# EAGLE design quadcopter (EAGLE 5.11)
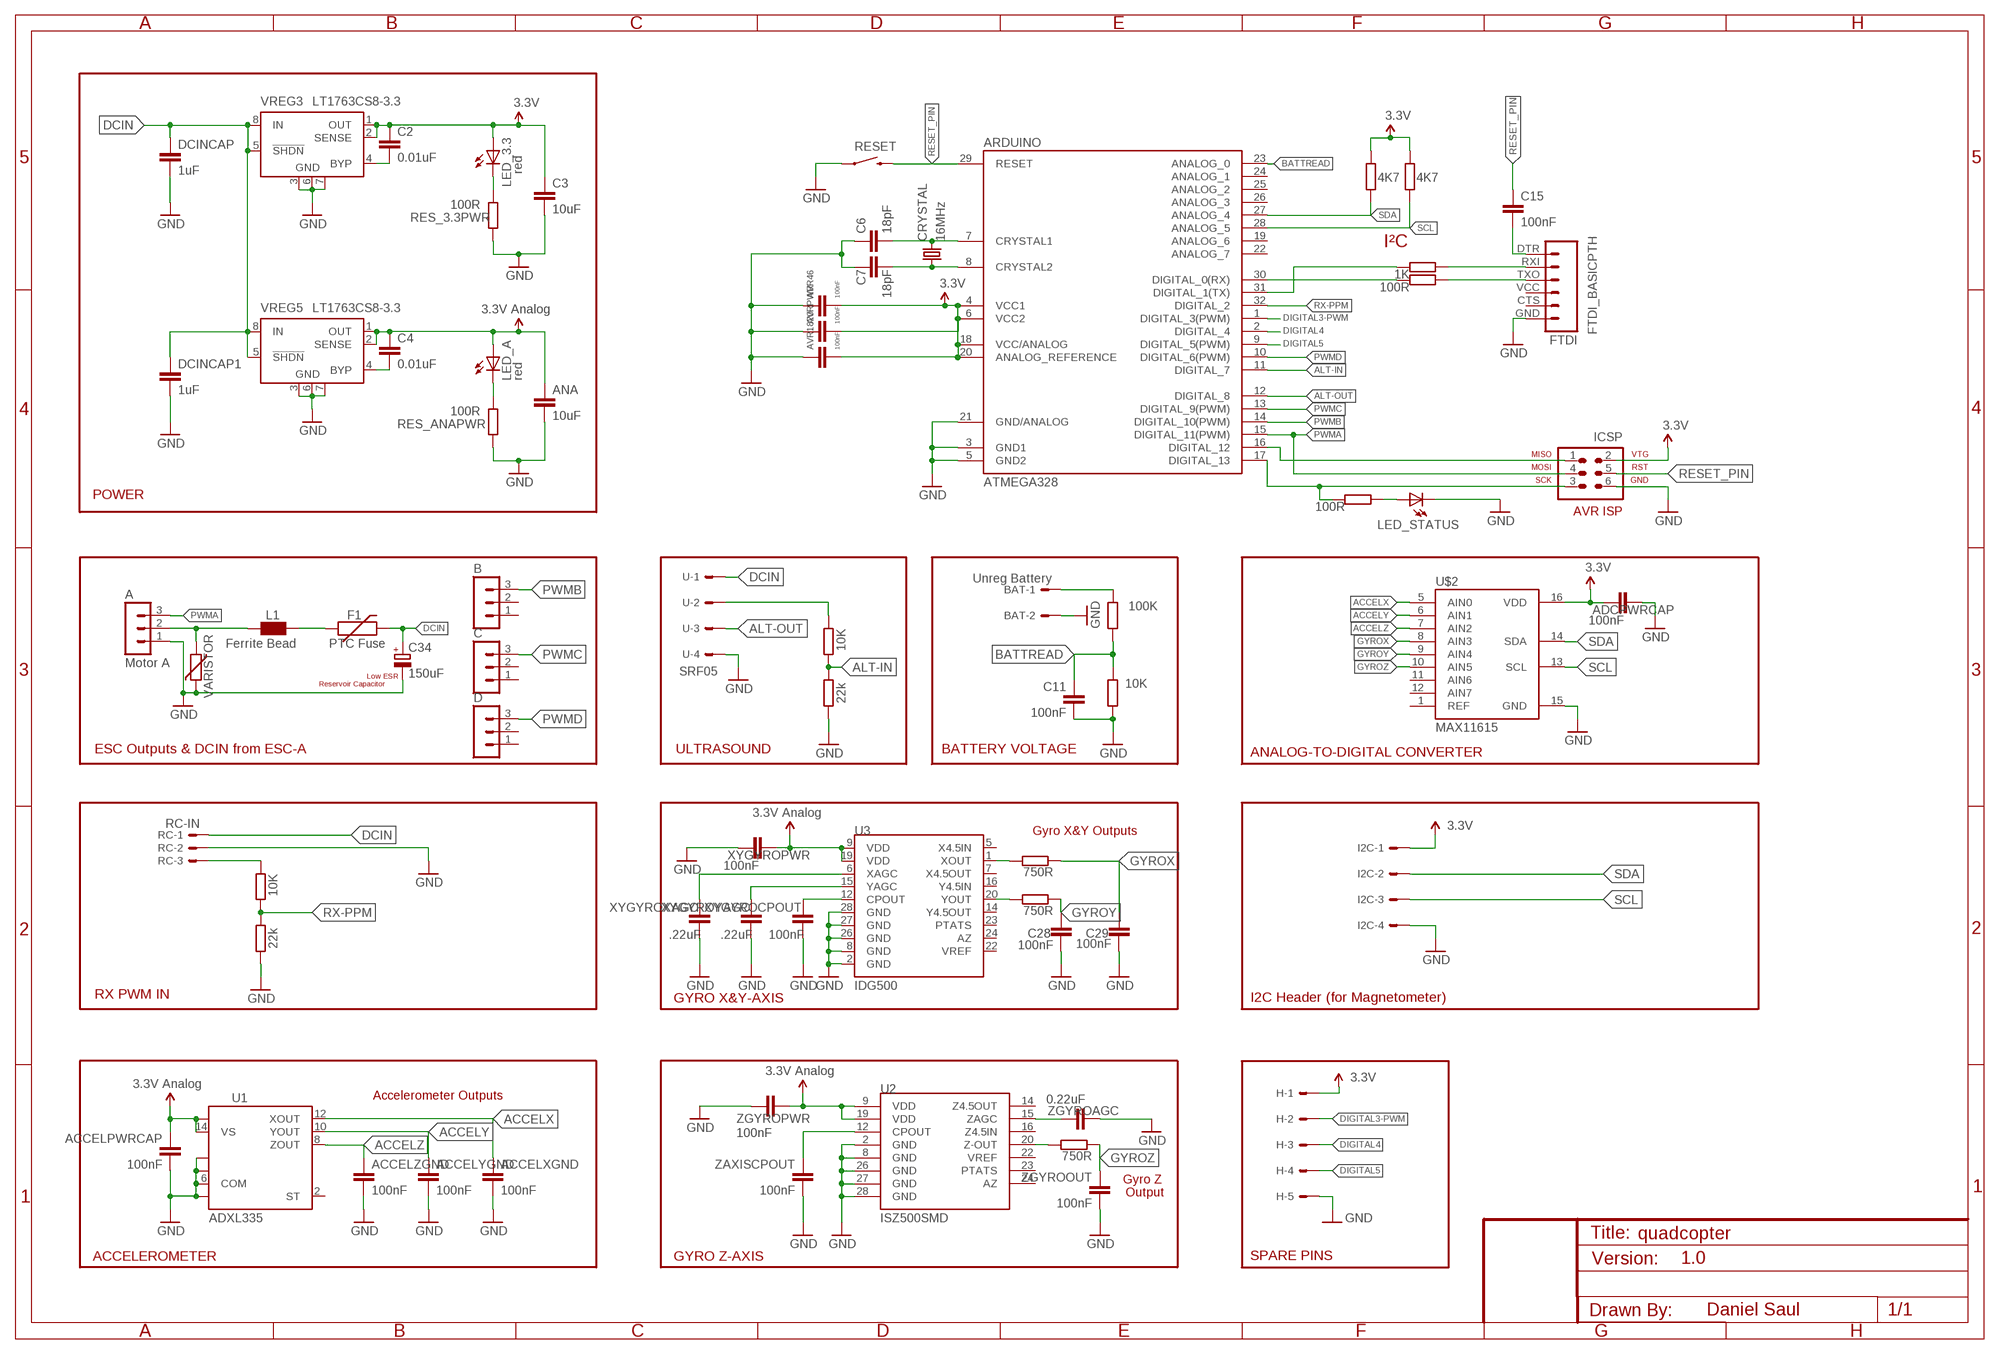
[diagram p0: schematic, sheet 1]

## Parts
A  Motor A  MA03-1  [MA03-1]
ACCELPWRCAP  100nF  CAP0805  [0805]
ACCELXGND  100nF  CAP0805  [0805]
ACCELYGND  100nF  CAP0805  [0805]
ACCELZGND  100nF  CAP0805  [0805]
ADCPWRCAP  100nF  CAP0805  [0805]
ANA  10uF  CAP0805  [0805]
ARDUINO  ATMEGA328  ATMEGA168-AU  [TQFP32-08]
AVR46  100nF  CAP0805  [0805]
AVR1820  100nF  CAP0805  [0805]
AVRPWR  100nF  CAP0805  [0805]
B  MA03-1  [MA03-1]
BAT  Unreg Battery  22-27-2021-02  [6410-02]
C  MA03-1  [MA03-1]
C2  0.01uF  CAP0805  [0805]
C3  10uF  CAP0805  [0805]
C4  0.01uF  CAP0805  [0805]
C6  18pF  CAP0805  [0805]
C7  18pF  CAP0805  [0805]
C11  100nF  CAP0805  [0805]
C15  100nF  CAP0805  [0805]
C28  100nF  CAP0805  [0805]
C29  100nF  CAP0805  [0805]
C34  150uF  CPOL-EUSANYO_SMD_E7  [SANYO-OSCON_SMD_E7]
CRYSTAL  16MHz  CRYSTAL5X3  [CRYSTAL-SMD-5X3]
D  MA03-1  [MA03-1]
DCINCAP  1uF  CAP0805  [0805]
DCINCAP1  1uF  CAP0805  [0805]
F1  PTC Fuse  PTCSMD  [PTC-1206]
FTDI  FTDI_BASICPTH  [FTDI_BASIC]
H  22-27-2051-05  [6410-05]
I2C  22-27-2041-04  [6410-04]
ICSP  AVR-ISP-6  [AVR-ISP-6]
L1  Ferrite Bead  WE-CBF_0603  [0603]
LED_3.3  red  LEDCHIP-LED0805  [CHIP-LED0805]
LED_A  red  LEDCHIP-LED0805  [CHIP-LED0805]
LED_STATUS  blue  LEDCHIP-LED0805  [CHIP-LED0805]
R1  VARISTOR  VARISTORCN1206  [CT/CN1206]
RC  RC-IN  22-23-2031  [22-23-2031]
RES_3.3PWR  100R  R-EU_R0805  [R0805]
RES_3.3PWR1  4K7  R-EU_R0805  [R0805]
RES_3.3PWR2  4K7  R-EU_R0805  [R0805]
RES_ANAPWR  100R  R-EU_R0805  [R0805]
RES_BATT  100K  R-EU_R0805  [R0805]
RES_BATT1  10K  R-EU_R0805  [R0805]
RES_BATT2  10K  R-EU_R0805  [R0805]
RES_BATT3  22k  R-EU_R0805  [R0805]
RES_BATT4  10K  R-EU_R0805  [R0805]
RES_BATT5  22k  R-EU_R0805  [R0805]
RES_SHT1  1K  R-EU_R0805  [R0805]
RES_SHT2  100R  R-EU_R0805  [R0805]
RES_SHT3  100R  R-EU_R0805  [R0805]
RES_WIND1  750R  R-EU_R0805  [R0805]
RES_WIND2  750R  R-EU_R0805  [R0805]
RES_WIND3  750R  R-EU_R0805  [R0805]
RESET  SWITCH-MOMENTARY-2-SMD-1101NE  [TACTILE-SWITCH-1101NE]
U  SRF05  22-27-2041-04  [6410-04]
U1  ADXL335  [LFCSP-16]
U2  ISZ500SMD  [QFN-28_6X8]
U3  IDG500  [SPARKFUN_IDG500]
U$2  MAX11615  MAX11615MAX11615  [QSOP16]
VREG3  LT1763CS8-3.3  [SOIC8]
VREG5  LT1763CS8-3.3  [SOIC8]
XYGYROCPOUT  100nF  CAP0805  [0805]
XYGYROPWR  100nF  CAP0805  [0805]
XYGYROXAGC  .22uF  CAP0805  [0805]
XYGYROYAGC  .22uF  CAP0805  [0805]
ZAXISCPOUT  100nF  CAP0805  [0805]
ZGYROAGC  0.22uF  CAP0805  [0805]
ZGYROOUT  100nF  CAP0805  [0805]
ZGYROPWR  100nF  CAP0805  [0805]

## Nets
3.3V: ADCPWRCAP.1 ARDUINO.4(VCC1) ARDUINO.6(VCC2) ARDUINO.18(VCC/ANALOG) ARDUINO.20(ANALOG_REFERENCE) AVR46.2 AVR1820.2 AVRPWR.2 C2.1 C3.1 H.1 I2C.1 ICSP.2 LED_3.3.A RES_3.3PWR1.1 RES_3.3PWR2.1 U$2.16(VDD) VREG3.1(OUT) VREG3.2(SENSE)
3.3VANALOG: ACCELPWRCAP.1 ANA.1 C4.1 LED_A.A U1.14(VS) U1.15(VS) U2.9(VDD) U2.19(VDD) U3.9(VDD) U3.19(VDD) VREG5.1(OUT) VREG5.2(SENSE) XYGYROPWR.2 ZGYROPWR.2 ; supply symbol labelled 3.3V Analog
16: ARDUINO.16(DIGITAL_12) ICSP.1
ACCELX: ACCELXGND.1 U1.12(XOUT) U$2.5(AIN0)
ACCELY: ACCELYGND.1 U1.10(YOUT) U$2.6(AIN1)
ACCELZ: ACCELZGND.1 U1.8(ZOUT) U$2.7(AIN2)
ALT-IN: ARDUINO.11(DIGITAL_7) RES_BATT2.2 RES_BATT3.1
ALT-OUT: ARDUINO.12(DIGITAL_8) U.3
BATTREAD: ARDUINO.23(ANALOG_0) C11.1 RES_BATT1.1 RES_BATT.2
DCIN: C34.+ DCINCAP1.1 DCINCAP.1 F1.2 RC.1 U.1 VREG3.5(!SHDN) VREG3.8(IN) VREG5.5(!SHDN) VREG5.8(IN)
DIGITAL3-PWM: ARDUINO.1(DIGITAL_3(PWM)) H.2
DIGITAL4: ARDUINO.2(DIGITAL_4) H.3
DIGITAL5: ARDUINO.9(DIGITAL_5(PWM)) H.4
GND: A.1 ACCELPWRCAP.2 ACCELXGND.2 ACCELYGND.2 ACCELZGND.2 ADCPWRCAP.2 ANA.2 ARDUINO.3(GND1) ARDUINO.5(GND2) ARDUINO.21(GND/ANALOG) AVR46.1 AVR1820.1 AVRPWR.1 BAT.2 C3.2 C6.1 C7.1 C11.2 C28.2 C29.2 C34.- DCINCAP1.2 DCINCAP.2 FTDI.GND H.5 I2C.4 ICSP.6 LED_STATUS.C R1.2 RC.2 RES_3.3PWR.2 RES_ANAPWR.2 RES_BATT1.2 RES_BATT3.2 RES_BATT5.2 RESET.P$1 U1.3(COM) U1.5(COM) U1.6(COM) U1.7(COM) U2.2(GND) U2.8(GND) U2.26(GND) U2.27(GND) U2.28(GND) U3.2(GND) U3.8(GND) U3.26(GND) U3.27(GND) U3.28(GND) U$2.15(GND) U.4 VREG3.3(GND) VREG3.6(GND) VREG3.7(GND) VREG5.3(GND) VREG5.6(GND) VREG5.7(GND) XYGYROCPOUT.2 XYGYROPWR.1 XYGYROXAGC.2 XYGYROYAGC.2 ZAXISCPOUT.2 ZGYROAGC.2 ZGYROOUT.2 ZGYROPWR.1
GYROX: C29.1 RES_WIND3.2 U$2.8(AIN3)
GYROY: C28.1 RES_WIND2.2 U$2.9(AIN4)
GYROZ: RES_WIND1.2 U$2.10(AIN5) ZGYROOUT.1
N$1: C4.2 VREG5.4(BYP)
N$2: BAT.1 RES_BATT.1
N$3: LED_3.3.C RES_3.3PWR.1
N$4: C2.2 VREG3.4(BYP)
N$5: LED_A.C RES_ANAPWR.1
N$7: ARDUINO.7(CRYSTAL1) C6.2 CRYSTAL.3
N$8: ARDUINO.8(CRYSTAL2) C7.2 CRYSTAL.1
N$11: FTDI.RXI RES_SHT1.2
N$12: FTDI.TXO RES_SHT3.2
N$13: C15.2 FTDI.DTR
N$14: F1.1 L1.2
N$15: RES_BATT2.1 U.2
N$16: ARDUINO.17(DIGITAL_13) ICSP.3 RES_SHT2.1
N$17: LED_STATUS.A RES_SHT2.2
N$19: RC.3 RES_BATT4.1
N$20: U2.15(ZAGC) ZGYROAGC.1
N$28: U2.12(CPOUT) ZAXISCPOUT.1
N$29: RES_WIND1.1 U2.20(Z-OUT)
N$30: U3.15(YAGC) XYGYROYAGC.1
N$31: U3.12(CPOUT) XYGYROCPOUT.1
N$32: U3.6(XAGC) XYGYROXAGC.1
N$33: RES_WIND2.1 U3.20(YOUT)
N$34: RES_WIND3.1 U3.1(XOUT)
PWMA: A.3 ARDUINO.15(DIGITAL_11(PWM)) ICSP.4
PWMB: ARDUINO.14(DIGITAL_10(PWM)) B.3
PWMC: ARDUINO.13(DIGITAL_9(PWM)) C.3
PWMD: ARDUINO.10(DIGITAL_6(PWM)) D.3
RC-IN1: ARDUINO.31(DIGITAL_1(TX)) RES_SHT1.1
RC-IN2: ARDUINO.30(DIGITAL_0(RX)) RES_SHT3.1
RESET_PIN: ARDUINO.29(RESET) C15.1 ICSP.5 RESET.P$2
RX-PPM: ARDUINO.32(DIGITAL_2) RES_BATT4.2 RES_BATT5.1
S: A.2 L1.1 R1.1
SCL: ARDUINO.28(ANALOG_5) I2C.3 RES_3.3PWR1.2 U$2.13(SCL)
SDA: ARDUINO.27(ANALOG_4) I2C.2 RES_3.3PWR2.2 U$2.14(SDA)
Unconnected: ARDUINO.19(ANALOG_6) ARDUINO.22(ANALOG_7) ARDUINO.24(ANALOG_1) ARDUINO.25(ANALOG_2) ARDUINO.26(ANALOG_3) B.1 B.2 C.1 C.2 D.1 D.2 FTDI.CTS FTDI.VCC U1.2(ST) U2.14(Z4.5OUT) U2.16(Z4.5IN) U2.22(VREF) U2.23(PTATS) U2.24(AZ) U3.5(X4.5IN) U3.7(X4.5OUT) U3.14(Y4.5OUT) U3.16(Y4.5IN) U3.22(VREF) U3.23(PTATS) U3.24(AZ) U$2.1(REF) U$2.11(AIN6) U$2.12(AIN7)

## Notes on the sheet
- I²C
- POWER
- Low ESR
- Reservoir Capacitor
- ESC Outputs & DCIN from ESC-A | ULTRASOUND | BATTERY VOLTAGE | ANALOG-TO-DIGITAL CONVERTER
- Gyro X&Y Outputs
- RX PWM IN | GYRO X&Y-AXIS | I2C Header (for Magnetometer)
- Accelerometer Outputs
- Gyro Z
- Output
- ACCELEROMETER | GYRO Z-AXIS | SPARE PINS | 1.0
- Daniel Saul

## Library data of the parts
A B C D = con-lstb:MA03-1: PIN HEADER; OC_FARNELL: unknown; OC_NEWARK: unknown
ACCELPWRCAP ACCELXGND ACCELYGND ACCELZGND ADCPWRCAP ANA AVR46 AVR1820 AVRPWR C2-C4 C6 C7 C11 C15 C28 C29 DCINCAP DCINCAP1 XYGYROCPOUT XYGYROPWR XYGYROXAGC XYGYROYAGC ZAXISCPOUT ZGYROAGC ZGYROOUT ZGYROPWR = SparkFun:CAP: Capacitor Standard 0603 ceramic capacitor, and 0.1" leaded capacitor.
ARDUINO = Arduino-AVR:ATMEGA168
BAT = con-molex:22-?-02: CONNECTOR wire to board 2.54 mm (.1 inch) pitch header; OC_FARNELL: unknown; OC_NEWARK: unknown
C34 = rcl:CPOL-EU: POLARIZED CAPACITOR, European symbol
CRYSTAL = SparkFun:CRYSTAL: Crystals Various standard crystals. Proven footprints. Spark Fun Electronics SKU : COM-00534
F1 = SparkFun:PTC: Resettable Fuse PTC Resettable Fuse. Spark Fun Electronics SKU : COM-08357
FTDI = SparkFun:FTDI_BASIC: FTDI Basic: 3.3V and 5V
H = con-molex:22-?-05: CONNECTOR wire to board 2.54 mm (.1 inch) pitch header; OC_FARNELL: unknown; OC_NEWARK: unknown
I2C U = con-molex:22-?-04: CONNECTOR wire to board 2.54 mm (.1 inch) pitch header; OC_FARNELL: unknown; OC_NEWARK: unknown
ICSP = avr-4:AVR-ISP-6: AVR ISP-6 Serial Programming Header
L1 = wuerth-elektronik:WE-CBF: SMD EMI Suppression Ferrite Beads - excellent anti-EMI properties - low DCR - impedances till 3000 ohms - rated current up to 6 A
LED_3.3 LED_A LED_STATUS = led:LED: LED OSRAM: - CHIPLED LG R971, LG N971, LY N971, LG Q971, LY Q971, LO R971, LY R971 LH N974, LH R974 LS Q976, LO Q976, LY Q976 LO Q996 - Hyper CHIPLED LW Q18S LB Q993, LB Q99A, LB R99A - SideLED LS A670, LO A670, LY A670, LG A670, LP A670 LB A673, LV A673, LT A673, LW A673 LH A674 LY A675 LS A676, LA A676, LO A676, LY A676, LW A676 LS A679, LY A679, LG A679 - Hyper Micro SIDELED® LS Y876, LA Y876, LO Y876, LY Y876 LT Y87S - SmartLED LW L88C, LW L88S LB L89C, LB L89S, LG L890 LS L89K, LO L89K, LY L89K LS L896, LA L896, LO L896, LY L896 - TOPLED LS T670, LO T670, LY T670, LG T670, LP T670 LSG T670, LSP T670, LSY T670, LOP T670, LYG T670 LG T671, LOG T671, LSG T671 LB T673, LV T673, LT T673, LW T673 LH T674 LS T676, LA T676, LO T676, LY T676, LB T676, LH T676, LSB T676, LW T676 LB T67C, LV T67C, LT T67C, LS T67K, LO T67K, LY T67K, LW E67C LS E67B, LA E67B, LO E67B, LY E67B, LB E67C, LV E67C, LT E67C LW T67C LS T679, LY T679, LG T679 LS T770, LO T770, LY T770, LG T770, LP T770 LB T773, LV T773, LT T773, LW T773 LH T774 LS E675, LA E675, LY E675, LS T675 LS T776, LA T776, LO T776, LY T776, LB T776 LHGB T686 LT T68C, LB T68C - Hyper Mini TOPLED® LB M676 - Mini TOPLED Santana® LG M470 LS M47K, LO M47K, LY M47K Source: http://www.osram.convergy.de LUXEON: - LUMILED® LXK2-PW12-R00, LXK2-PW12-S00, LXK2-PW14-U00, LXK2-PW14-V00 LXK2-PM12-R00, LXK2-PM12-S00, LXK2-PM14-U00 LXK2-PE12-Q00, LXK2-PE12-R00, LXK2-PE12-S00, LXK2-PE14-T00, LXK2-PE14-U00 LXK2-PB12-K00, LXK2-PB12-L00, LXK2-PB12-M00, LXK2-PB14-N00, LXK2-PB14-P00, LXK2-PB14-Q00 LXK2-PR12-L00, LXK2-PR12-M00, LXK2-PR14-Q00, LXK2-PR14-R00 LXK2-PD12-Q00, LXK2-PD12-R00, LXK2-PD12-S00 LXK2-PH12-R00, LXK2-PH12-S00 LXK2-PL12-P00, LXK2-PL12-Q00, LXK2-PL12-R00 Source: www.luxeon.com KINGBRIGHT: KA-3528ASYC Source: www.kingbright.com
R1 = varistor:VARISTOR: VARISTOR
RC = con-molex:22-23-2031: .100" (2.54mm) Center Header - 3 Pin; MF: MOLEX; MPN: 22-23-2031; OC_FARNELL: 1462950; OC_NEWARK: 30C0862
RES_3.3PWR RES_3.3PWR1 RES_3.3PWR2 RES_ANAPWR RES_BATT RES_BATT1-RES_BATT5 RES_SHT1-RES_SHT3 RES_WIND1-RES_WIND3 = resistor:R-EU_: RESISTOR, European symbol
RESET = SparkFun:SWITCH-MOMENTARY-2
U1 = SparkFun:ADXL335
U2 = SparkFun:ISZ500: ISZ500 Single axis gyro
U3 = SparkFun:IDG500
U$2 = max1708:MAX11615
VREG3 VREG5 = linear-technology:LT1763CS8: 500mA, Low Noise, LDO Micropower Regulators Source: http://cds.linear.com/docs/Datasheet/1763ff.pdf; MPN: LT1763CS8-3.3; OC_FARNELL: 1273617; OC_NEWARK: 57M6055

## Board
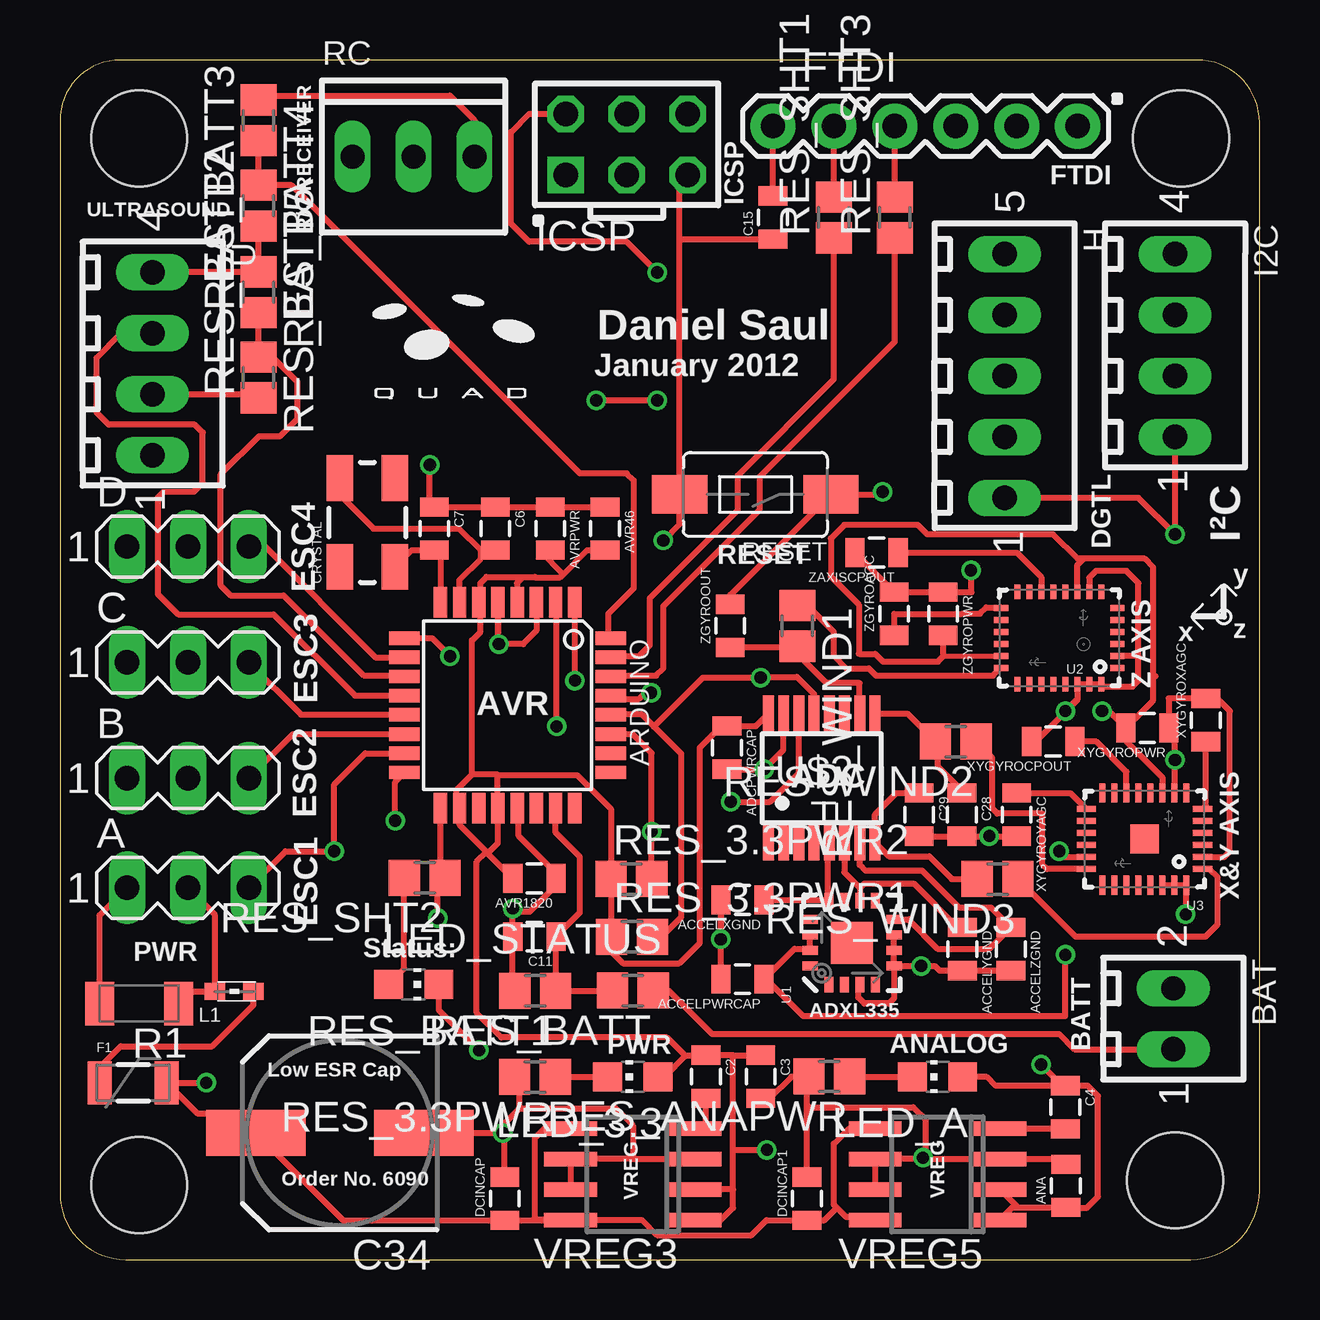
[diagram p1: board, top side]
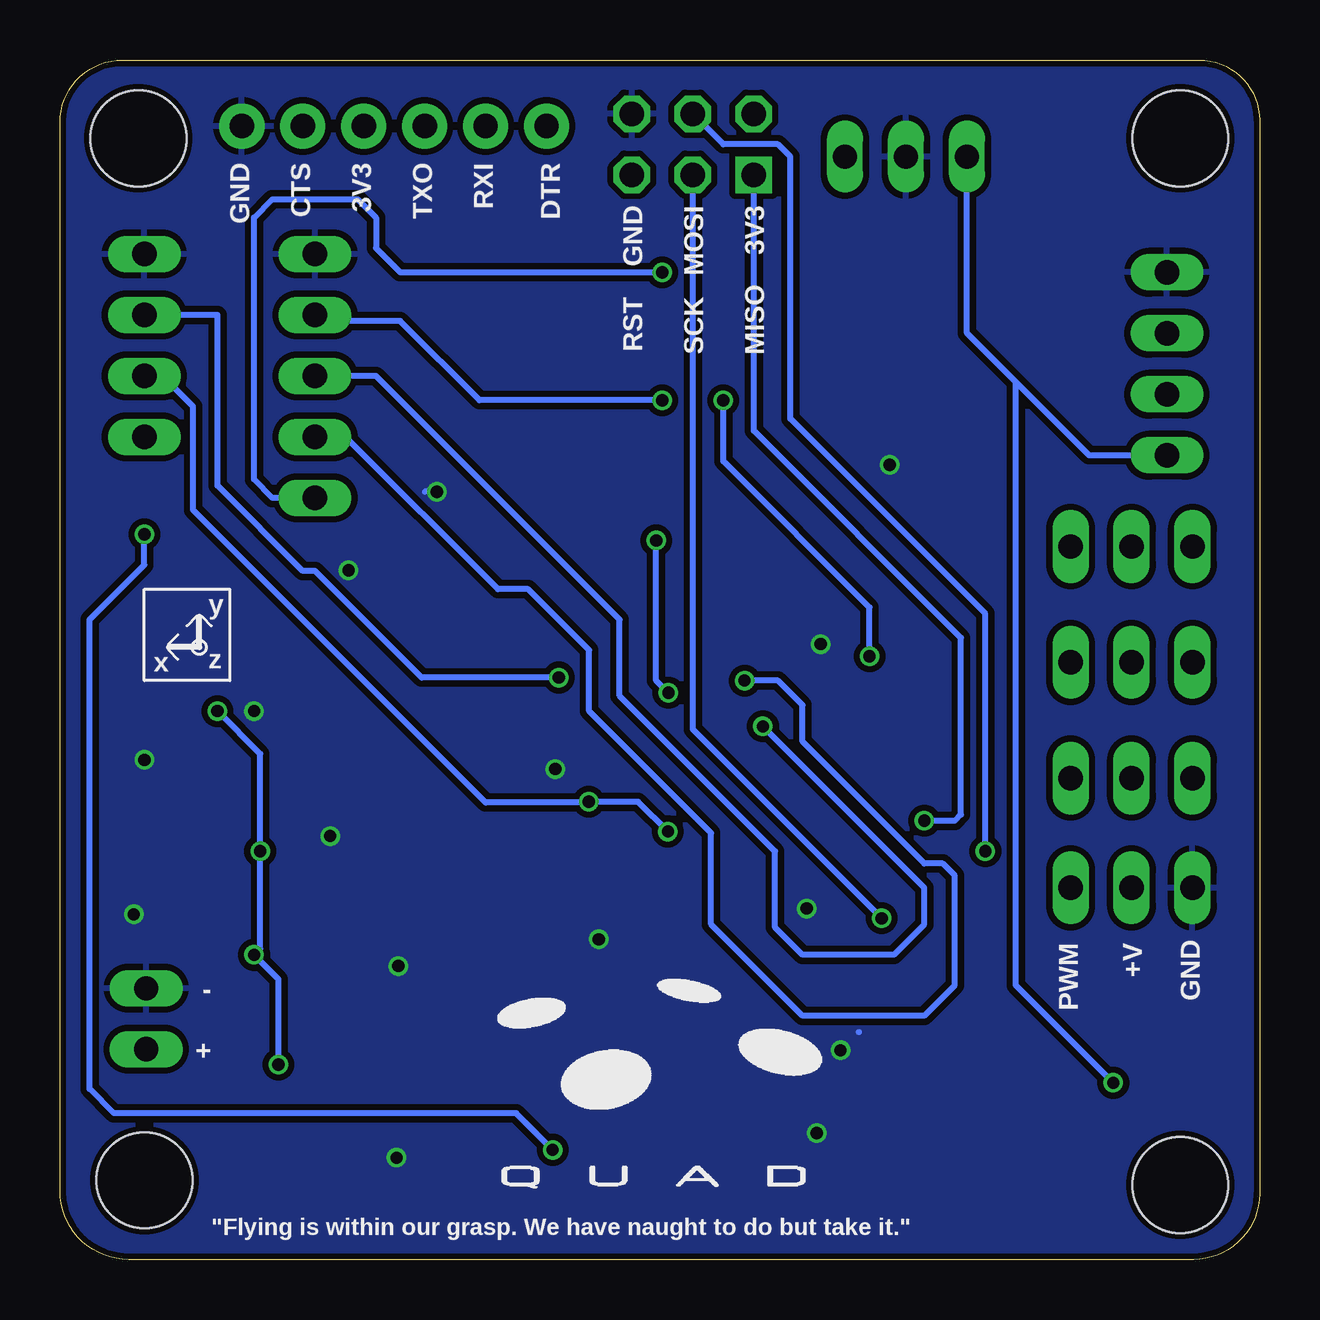
[diagram p2: board, bottom side, seen from below]

Size 50 x 50 mm. Coordinates in mm from the lower left corner, seen from the top.
Outline: 0,47.49 0,2.75 arc90 2.75,0 47.13,0 arc90 50,2.87 50,47.4 arc90 47.4,50 2.51,50 arc90 0,47.49
Copper layers (1*16): Top 0.035mm / dielectric 1.5mm / Bottom 0.035mm
Design rules: minimum track width 10mil, minimum drill 12mil, track to track 10mil, track to pad 6mil, pad to pad 6mil, via to via 6mil, smd to smd 0mil, copper to edge 10mil, drill to drill 10mil, minimum pad ring 10mil, minimum via ring 6mil, stop-mask expansion 2mil, vias tented up to drill 100mil, thermal gap 10mil
Holes 4 mm at 46.74,46.74 46.48,3.3 3.3,3.11 3.3,46.74

### Footprints (pad centres in the part's own frame; a part is rotated, then mirrored left to right if it is on the bottom)
MA03-1 = drill 1.016 long: 1 -2.54,0; 2 0,0; 3 2.54,0
0805 = smd 0.8 x 1.2: 1 -0.9,0; 2 0.9,0
TQFP32-08 = smd 1.27 x 0.559: 1 -4.293,2.8; 2 -4.293,2; 3 -4.293,1.2; 4 -4.293,0.4; 5 -4.293,-0.4; 6 -4.293,-1.2; 7 -4.293,-2; 8 -4.293,-2.8; 17 4.293,-2.8; 18 4.293,-2; 19 4.293,-1.2; 20 4.293,-0.4; 21 4.293,0.4; 22 4.293,1.2; 23 4.293,2; 24 4.293,2.8 | smd 0.559 x 1.27: 9 -2.8,-4.293; 10 -2,-4.293; 11 -1.2,-4.293; 12 -0.4,-4.293; 13 0.4,-4.293; 14 1.2,-4.293; 15 2,-4.293; 16 2.8,-4.293; 25 2.8,4.293; 26 2,4.293; 27 1.2,4.293; 28 0.4,4.293; 29 -0.4,4.293; 30 -1.2,4.293; 31 -2,4.293; 32 -2.8,4.293
6410-02 = drill 1.016 long: 1 1.27,0; 2 -1.27,0
SANYO-OSCON_SMD_E7 = smd 4.15 x 1.9: + 3.5,0; - -3.5,0
CRYSTAL-SMD-5X3 = smd 1.9 x 1.1: 1 -1.85,-1.15; 2 1.85,-1.15; 3 1.85,1.15; 4 -1.85,1.15
PTC-1206 = smd 1 x 1.8: 1 -1.4,0; 2 1.4,0
FTDI_BASIC = drill 1.016 pad 1.88: CTS 10.16,0; DTR 0,0; GND 12.7,0; RXI 2.54,0; TXO 5.08,0; VCC 7.62,0
6410-05 = drill 1.016 long: 1 5.08,0; 2 2.54,0; 3 0,0; 4 -2.54,0; 5 -5.08,0
6410-04 = drill 1.016 long: 1 3.81,0; 2 1.27,0; 3 -1.27,0; 4 -3.81,0
AVR-ISP-6 = drill 1.016 square: 1 -2.54,-1.27 | drill 1.016 octagon: 2 -2.54,1.27; 3 0,-1.27; 4 0,1.27; 5 2.54,-1.27; 6 2.54,1.27
0603 = smd 0.85 x 0.7: 1 -0.9,0; 2 0.7,0
CHIP-LED0805 = smd 1.2 x 1.2: A 0,-1.05; C 0,1.05
CT/CN1206 = smd 1.2 x 1.8: 1 -1.65,0; 2 1.65,0
22-23-2031 = drill 1 long: 1 -2.54,0; 2 0,0; 3 2.54,0
R0805 = smd 1.3 x 1.5: 1 -0.85,0; 2 0.85,0
TACTILE-SWITCH-1101NE = smd 2.3 x 1.6: P$1 -3.15,0; P$2 3.15,0
LFCSP-16 = smd 1.75 x 1.75: 0 0,0 | smd 0.65 x 0.37: 1 -1.75,0.975; 2 -1.75,0.325; 3 -1.75,-0.325; 4 -1.75,-0.975; 9 1.75,-0.975; 10 1.75,-0.325; 11 1.75,0.325; 12 1.75,0.975 | smd 0.37 x 0.65: 5 -0.975,-1.75; 6 -0.325,-1.75; 7 0.325,-1.75; 8 0.975,-1.75; 13 0.975,1.75; 14 0.325,1.75; 15 -0.325,1.75; 16 -0.975,1.75
QFN-28_6X8 = smd 0.6 x 0.25: 1 -2.417,1.25; 2 -2.417,0.75; 3 -2.417,0.25; 4 -2.417,-0.25; 5 -2.417,-0.75; 6 -2.417,-1.25; 15 2.433,-1.25; 16 2.433,-0.75; 17 2.433,-0.25; 18 2.433,0.25; 19 2.433,0.75; 20 2.433,1.25 | smd 0.25 x 0.6: 7 -1.742,-1.925; 8 -1.242,-1.925; 9 -0.742,-1.925; 10 -0.242,-1.925; 11 0.258,-1.925; 12 0.758,-1.925; 13 1.258,-1.925; 14 1.758,-1.925; 21 1.758,1.925; 22 1.258,1.925; 23 0.758,1.925; 24 0.258,1.925; 25 -0.242,1.925; 26 -0.742,1.925; 27 -1.242,1.925; 28 -1.742,1.925
SPARKFUN_IDG500 = smd 0.8 x 0.25: 1 -2.417,1.25; 2 -2.417,0.75; 3 -2.417,0.25; 4 -2.417,-0.25; 5 -2.417,-0.75; 6 -2.417,-1.25; 15 2.433,-1.25; 16 2.433,-0.75; 17 2.433,-0.25; 18 2.433,0.25; 19 2.433,0.75; 20 2.433,1.25 | smd 0.25 x 0.8: 7 -1.742,-1.925; 8 -1.242,-1.925; 9 -0.742,-1.925; 10 -0.242,-1.925; 11 0.258,-1.925; 12 0.758,-1.925; 13 1.258,-1.925; 14 1.758,-1.925; 21 1.758,1.925; 22 1.258,1.925; 23 0.758,1.925; 24 0.258,1.925; 25 -0.242,1.925; 26 -0.742,1.925; 27 -1.242,1.925; 28 -1.742,1.925 | smd 1.2 x 1.2: NC 0,0
QSOP16 = smd 0.45 x 1.5: 1 -2.223,-2.69; 2 -1.587,-2.69; 3 -0.953,-2.69; 4 -0.318,-2.69; 5 0.318,-2.69; 6 0.953,-2.69; 7 1.587,-2.69; 8 2.223,-2.69; 9 2.223,2.69; 10 1.587,2.69; 11 0.953,2.69; 12 0.318,2.69; 13 -0.318,2.69; 14 -0.953,2.69; 15 -1.587,2.69; 16 -2.223,2.69
SOIC8 = smd 0.6 x 2.2: 1 -1.905,-2.6; 2 -0.635,-2.6; 3 0.635,-2.6; 4 1.905,-2.6; 5 1.905,2.6; 6 0.635,2.6; 7 -0.635,2.6; 8 -1.905,2.6

### Placement (x,y rotation side)
A  5.33,15.49 0 top
ACCELPWRCAP  28.45,11.68 180 top
ACCELXGND  28.45,14.99 180 top
ACCELYGND  37.62,12.94 270 top
ACCELZGND  39.64,12.94 270 top
ADCPWRCAP  27.8,21.34 270 top
ANA  41.92,3.07 90 top
ARDUINO  18.66,23.1 270 top
AVR46  22.72,30.47 270 top
AVR1820  19.77,15.89 180 top
AVRPWR  20.43,30.47 270 top
B  5.33,20.07 0 top
BAT  46.41,10.03 270 top
C  5.33,24.89 0 top
C2  26.92,7.62 270 top
C3  29.21,7.62 270 top
C4  41.91,6.35 270 top
C6  18.15,30.47 270 top
C7  15.61,30.47 270 top
C11  19.77,13.46 180 top
C15  29.72,43.43 90 top
C28  37.59,18.54 270 top
C29  35.81,18.54 270 top
C34  11.66,5.28 180 top
CRYSTAL  12.81,30.72 90 top
D  5.33,29.72 0 top
DCINCAP  18.54,2.54 90 top
DCINCAP1  31.14,2.54 90 top
F1  3.05,7.37 0 top
FTDI  29.72,47.24 0 top
H  39.37,36.83 270 top
I2C  46.48,38.1 270 top
ICSP  23.62,46.48 0 top
L1  7.37,11.18 0 top
LED_3.3  23.88,7.62 90 top
LED_A  36.58,7.62 90 top
LED_STATUS  14.74,11.47 270 top
R1  3.3,10.67 180 top
RC  14.73,45.97 0 top
RES_3.3PWR  19.8,7.61 180 top
RES_3.3PWR1  23.84,13.45 0 top
RES_3.3PWR2  23.81,15.85 0 top
RES_ANAPWR  32.07,7.64 180 top
RES_BATT  23.88,11.21 180 top
RES_BATT1  19.81,11.2 180 top
RES_BATT2  8.28,36.76 90 top
RES_BATT3  8.28,40.32 90 top
RES_BATT4  8.28,47.48 270 top
RES_BATT5  8.28,43.93 270 top
RES_SHT1  32.26,43.43 90 top
RES_SHT2  15.2,15.91 180 top
RES_SHT3  34.8,43.43 90 top
RES_WIND1  30.73,26.42 270 top
RES_WIND2  37.34,21.59 180 top
RES_WIND3  39.08,15.86 180 top
RESET  28.98,31.89 180 top
U  3.86,37.34 270 top
U1  33.02,13.21 90 top
U2  41.66,25.91 180 top
U3  45.21,17.53 180 top
U$1  [LOGO]  33.5,1.09 0 bottom
U$2  31.75,20.07 0 top
VREG3  23.88,3.56 90 top
VREG5  36.58,3.56 90 top
XYGYROCPOUT  41.4,21.59 180 top
XYGYROPWR  45.32,22.16 180 top
XYGYROXAGC  47.76,22.49 90 top
XYGYROYAGC  39.88,18.54 270 top
ZAXISCPOUT  34.04,29.46 180 top
ZGYROAGC  34.77,26.92 90 top
ZGYROOUT  27.94,26.42 90 top
ZGYROPWR  36.81,26.92 270 top

### Tracks (layer width: path | path; a pad name or v marks a point on that pad's centre or on a via)
3.3V  (via drill 0.51)
  Top 0.254: U$2.16 29.01,22.24 ADCPWRCAP.1 27.57,22.24 26.67,21.34 26.67,13.2 25.82,12.35 23.46,12.35 22.99,12.82 RES_3.3PWR1.1 22.96,13.48 RES_3.3PWR2.1 22.96,18.79 21.55,20.2 18.27,20.2 18.25,20.22 | AVRPWR.2 20.04,29.57 20.04,29.49 20.97,28.56 | ARDUINO.18 16.66,18.11 17.77,16.99 | 17.83,16.93 AVR1820.2 | 17.77,16.99 17.83,16.93 | 17.83,16.93 18.26,17.36 ARDUINO.20 18.25,18.82 18.25,20.22 | 28.05,8.52 C2.1 26.89,8.48 26.07,8.48 | 28.05,2.92 28.05,4.57 | 28.05,4.57 28.05,8.52 | 28.05,2.92 VREG3.2 | C3.1 28.06,8.52 28.05,8.52 | ARDUINO.4 19.05,28.19 19.29,28.43 19.81,28.43 | AVR46.2 21.97,29.57 20.97,28.56 | 20.97,28.56 20.84,28.43 19.81,28.43 | LED_3.3.A 24.93,7.64 25.23,7.64 26.07,8.48 | 17.77,16.99 17.37,16.59 17.37,10.29 18.41,9.26 25.3,9.26 26.07,8.48 | ARDUINO.6 | I2C.1 v46.48,30.23 44.96,31.75 H.1 | 28.05,4.57 v29.46,4.57 | ARDUINO.6 17.51,27.45 | 18.25,20.22 17.17,20.22 | 17.17,20.22 16.51,19.56 16.51,19.3 16.76,19.05 | 17.17,20.22 17.17,25.81 17.53,26.16 17.53,27.32 | 17.53,27.32 ARDUINO.6 | 28.05,2.92 28.05,2.15 27.43,1.52 26.6,1.52 VREG3.1 | 17.53,27.32 17.53,28.19 17.78,28.45 19.8,28.45 19.81,28.43 | ICSP.2 19.56,47.75 18.8,46.99 18.8,43.18 19.56,42.42 23.62,42.42 v24.89,41.15
  Bottom 0.254: v29.46,4.57 30.99,6.1 47.75,6.1 48.77,7.11 48.77,26.67 46.48,28.96 v46.48,30.23 | v24.89,41.15 35.81,41.15 36.83,42.16 36.83,43.43 37.59,44.2 41.15,44.2 41.91,43.43 41.91,32.51 41.15,31.75 H.1
3.3VANALOG  (via drill 0.51)
  Top 0.203: 36.83,25.16 U2.19
  Top 0.254: U1.14 U1.15 31.2,12.95 30.62,12.95 ACCELPWRCAP.1 29.44,11.68 30.99,10.14 41.89,10.14 41.89,12.68 v41.91,12.7 41.94,12.67 | C4.1 42.84,7.25 43.27,6.82 43.27,2.62 42.8,2.15 41.95,2.15 ANA.1 39.92,2.17 | C4.1 38.99,7.25 38.63,7.61 37.64,7.61 LED_A.A | U2.9 42.39,27.84 42.39,28.93 42.67,29.21 | 45.57,24.23 45.66,24.32 | ZGYROPWR.2 36.83,26.01 36.83,25.16 36.59,24.93 34.3,24.93 33.99,25.24 33.31,25.24 33.3,25.26 33.3,27.3 32.13,28.46 32.13,30.06 32.69,30.62 35.76,30.62 36.15,30.23 41.4,30.23 42.42,29.21 42.67,29.21 | 45.57,24.23 45.57,23.31 XYGYROPWR.2 | 45.57,24.23 45.57,28.85 45.21,29.21 42.67,29.21 | U3.9 45.95,20.09 44.45,21.59 44.45,22.13 XYGYROPWR.2 | C4.1 41.77,7.25 v40.89,8.13 | U3.19 41.9,16.78 v41.66,17.02 | v43.43,22.86 43.72,22.86 XYGYROPWR.2 | 39.92,2.17 VREG5.2 | 39.92,2.17 39.7,2.17 VREG5.1
  Bottom 0.254: v40.89,8.13 40.89,11.68 v41.91,12.7 41.66,12.95 v41.66,17.02 41.66,21.08 v43.43,22.86
16  (via drill 0.51)
  Top 0.254: v13.97,18.29 13.97,19.91 ARDUINO.16
  Bottom 0.254: ICSP.1 21.08,34.54 12.45,25.91 12.45,18.54 12.7,18.29 v13.97,18.29
ACCELX
  Top 0.254: ACCELXGND.1 32.02,14.99 | 32.02,14.99 U1.12 | 32.02,14.99 32.02,17.33 U$2.5
ACCELY
  Top 0.254: 33.34,15.49 33.34,15.53 33.3,15.53 32.69,16.14 32.69,17.36 U$2.6 | 33.34,15.49 U1.10 | ACCELYGND.1 37.42,13.84 35.59,15.67 33.52,15.67 33.34,15.49
ACCELZ
  Top 0.254: U1.8 35.4,14.18 35.4,14.13 36.58,12.95 38.74,12.95 39.63,13.84 ACCELZGND.1 38.82,14.66 37.48,14.66 35.94,16.2 33.58,16.2 33.34,16.44 U$2.7
ALT-IN
  Top 0.254: RES_BATT2.2 RES_BATT3.1 | ARDUINO.11 14.58,24.3 14.63,24.35 12.66,24.35 9.32,27.69 7.11,27.69 6.71,28.09 6.71,32.73 8.3,34.32 9.18,34.32 9.91,35.05 9.91,36.58 8.89,37.59 8.3,37.59 RES_BATT2.2 | RES_BATT2.2
ALT-OUT
  Top 0.254: ARDUINO.12 12.29,23.5 8.9,26.89 4.93,26.89 4.09,27.72 4.09,31.78 4.32,32 5.59,32 5.95,32.37 5.95,34.47 5.62,34.8 2.03,34.8 1.52,35.31 1.52,37.59 2.54,38.61 U.3
BATTREAD
  Top 0.254: ARDUINO.23 20.66,17.79 21.68,16.77 21.68,14.46 C11.1 20.67,11.21 RES_BATT1.1 23.01,11.2 RES_BATT.2
DCIN  (via drill 0.51)
  Top 0.254: 19.81,1.64 DCINCAP.1 11.8,1.64 C34.+ 7.35,6.1 5.72,6.1 F1.2 v6.1,7.37 | 19.81,1.64 21.27,1.64 VREG3.8 | VREG3.8 19.72,1.65 | VREG5.5 32.89,5.46 32.26,4.83 32.26,2.29 32.38,2.16 | 32.38,2.16 32.77,1.78 33.85,1.78 VREG5.8 | 32.38,2.16 31.87,1.64 DCINCAP1.1 29.45,1.64 28.83,1.02 24.89,1.02 24.26,1.65 VREG3.8 | VREG3.5 20.19,5.46 19.81,5.08 19.81,1.64
  Bottom 0.254: RC.1 12.19,38.61 10.16,36.58 | 10.16,36.58 7.11,33.53 U.1 | v6.1,7.37 10.16,11.43 10.16,36.58
DIGITAL3-PWM  (via drill 0.51)
  Top 0.254: v21.46,24.13 ARDUINO.1
  Bottom 0.254: H.2 38.1,34.29 31.75,27.94 30.48,27.94 27.94,25.4 27.94,22.86 22.86,17.78 22.86,13.97 19.05,10.16 13.97,10.16 12.7,11.43 12.7,16 13.21,16.51 13.97,16.51 19.05,21.59 19.05,23.11 20.07,24.13 v21.46,24.13
DIGITAL4  (via drill 0.51)
  Top 0.254: v20.7,22.23 20.7,27.35 ARDUINO.2
  Bottom 0.254: H.3 36.83,36.83 26.67,26.67 26.67,23.5 20.19,17.02 20.19,13.84 19.05,12.7 15.24,12.7 13.97,13.97 13.97,15.49 v20.7,22.23
DIGITAL5  (via drill 0.51)
  Top 0.254: ARDUINO.9 15.5,25.9 v16.26,25.15 | v22.35,35.81 v24.89,35.81
  Bottom 0.254: v16.26,25.15 16.26,27.18 22.35,33.27 v22.35,35.81 | v24.89,35.81 32.51,35.81 35.81,39.12 39.12,39.12 H.4
GND  (via drill 0.51)
  Top 0.254: AVR46.1 AVRPWR.1 C6.1 C7.1 15.41,31.56 v15.41,33.13 | R1.2 1.65,14.35 A.1 | VREG3.7 VREG3.6 23.88,4.19 | RES_3.3PWR.2 19.16,7.39 19.16,6.31 | 35.95,4.19 VREG5.3 41.7,4.19 ANA.2 | VREG5.7 VREG5.6 35.95,4.19 | 35.95,4.19 35.97,4.2 | ARDUINO.3 19.86,26.21 19.3,25.65 v18.29,25.65 18.26,25.69 ARDUINO.5 18.26,26.11 | RES_BATT5.2 RES_BATT3.2 3.88,41.17 U.4 | C28.2 XYGYROYAGC.2 | C29.2 C28.2 | ACCELZGND.2 ACCELYGND.2 36.66,12.04 36.47,12.23 36.11,12.23 | U1.5 36.11,12.23 | U1.5 U1.6 U1.7 | ADCPWRCAP.2 v29.35,20.44 | v29.35,20.44 30.16,21.24 30.16,22.75 U$2.15 | ACCELPWRCAP.2 ACCELXGND.2 v27.55,13.35 v27.54,13.35 | 46.45,20.86 U3.8 | U3.26 U3.27 U3.28 46.95,14.42 v46.93,14.39 | XYGYROCPOUT.2 40.67,21.59 42.42,23.34 | 42.42,23.34 42.42,23.96 U2.26 U2.27 U2.28 43.51,23.88 44.7,23.88 44.96,24.13 44.96,25.15 | ARDUINO.21 19.12,18.74 19.12,17.65 20.67,16.1 AVR1820.1 20.67,15.59 19.59,14.5 19.01,14.5 v18.88,14.63 v18.87,14.63 C11.2 | v18.87,14.63 C11.2 | C11.2 18.87,11.29 RES_BATT1.2 | C34.- 18.43,5.28 | 18.43,5.28 18.47,5.28 18.51,5.25 | 18.51,5.25 18.51,5.66 19.16,6.31 | 18.51,5.25 18.51,3.47 DCINCAP.2 | v29.35,20.44 v29.36,20.44 | v18.46,5.27 18.45,5.27 18.43,5.28 | LED_STATUS.C 15.79,10.39 v17.46,8.72 | 35.95,4.19 35.95,4.23 v35.97,4.24 36.07,4.34 36.07,5.84 35.56,6.35 31.24,6.35 31.14,6.45 | v35.89,12.24 36.1,12.24 36.11,12.23 | ZGYROAGC.2 ZGYROPWR.1 37.99,27.82 37.99,28.71 v37.97,28.73 | ZGYROAGC.2 | ZGYROAGC.2 34.77,27.83 ZAXISCPOUT.2 | 42.42,23.34 42.4,23.34 v41.91,22.86 | C28.2 v38.72,17.64 v38.73,17.65 | U3.2 48.53,16.78 48.77,17.02 48.77,22.86 48.26,23.37 47.78,23.37 XYGYROXAGC.2 46.2,23.39 46.22,23.37 XYGYROPWR.1 46.45,21.93 46.45,20.86
  Top 0.254: 46.45,20.86 v46.48,20.83 | ZGYROOUT.2 27.94,27.7 RESET.P$1 34.18,31.89 v34.29,32 | 23.88,4.19 VREG3.3 | 19.16,6.31 23.15,6.31 23.88,5.59 23.88,4.19 | C3.2 29.58,6.72 30.48,7.62 31.2,7.62 | DCINCAP1.2 31.14,6.45 | 31.2,7.62 31.14,7.56 31.14,6.45 | 31.2,7.62 RES_ANAPWR.2 | U1.5 34.77,10.89 34.54,10.67 33.53,10.67 33.27,10.92 33.27,11.39 U1.3 | U2.8 42.9,28.42 43.18,28.7 44.45,28.7 44.96,28.19 44.96,25.15 | U2.2 44.95,25.16 44.96,25.15
  Bottom 0.254: v18.88,14.63 18.88,14.61 | 16.69,9.48 16.7,9.48 | v34.29,32 34.8,32 | v18.29,25.65 18.29,25.4
  pour Bottom (isolate 0.254): 50.13,49.95 49.95,0.01 1.39,0.01 arc-90 0.02,2.92 -0.09,50.14
GYROX
  Top 0.254: C29.1 34.86,19.44 33.97,18.55 U$2.8 34.55,16.8 36.24,16.8 37.17,15.86 RES_WIND3.2
GYROY
  Top 0.254: U$2.9 35.32,22.76 RES_WIND2.2 36.58,21.5 36.58,20.57 37.59,19.56 C28.1
GYROZ
  Top 0.254: ZGYROOUT.1 30.68,25.52 RES_WIND1.2 30.73,25.25 31.95,24.03 33.33,24.03 33.33,22.77 U$2.10
N$1
  Top 0.254: VREG5.4 41.9,5.46 C4.2
N$2
  Top 0.254: RES_BATT.1 25.36,11.21 27.18,9.4 41.66,9.4 42.29,8.76 BAT.1
N$3
  Top 0.254: LED_3.3.C 20.66,7.62 RES_3.3PWR.1
N$4
  Top 0.254: C2.2 26.92,5.58 27.05,5.45 26.49,5.45 VREG3.4
N$5
  Top 0.254: LED_A.C 32.93,7.62 RES_ANAPWR.1
N$7
  Top 0.254: 17.52,29.57 C6.2 | 17.52,29.57 16.62,30.47 13.07,30.47 11.8,31.74 11.8,32.44 CRYSTAL.3 | 17.52,29.57 17.52,29.21 16.64,28.32 16.64,27.41 ARDUINO.7
N$8
  Top 0.254: ARDUINO.8 15.86,29.32 C7.2 14.66,29.57 CRYSTAL.1
N$11
  Top 0.254: RES_SHT1.2 FTDI.RXI
N$12
  Top 0.254: RES_SHT3.2 FTDI.TXO
N$13
  Top 0.254: C15.2 FTDI.DTR
N$14
  Top 0.254: L1.2 8.07,10.61 6.35,8.89 2.54,8.89 1.27,7.62 1.39,7.62 F1.1
N$15
  Top 0.254: U.2 8.13,36.07 RES_BATT2.1
N$16  (via drill 0.51)
  Top 0.254: ARDUINO.17 15.86,16.11 RES_SHT2.1 15.75,15.61 v15.75,14.22
  Bottom 0.254: ICSP.3 23.62,22.1 v15.75,14.22
N$17
  Top 0.254: RES_SHT2.2 14.35,12.12 LED_STATUS.A
N$19
  Top 0.254: RES_BATT4.1 8.31,48.3 | RES_BATT4.1 8.35,48.26 | RC.3 17.27,47.5 16.26,48.51 8.46,48.51 RES_BATT4.1
N$20
  Top 0.254: U2.15 39.2,27.18 38.61,27.18 38.35,26.92 37.59,26.92 37.58,26.91 34.78,26.91 ZGYROAGC.1
N$28
  Top 0.254: U2.12 40.9,28.44 39.88,29.46 ZAXISCPOUT.1
N$29
  Top 0.254: U2.20 38.89,24.34 34.02,24.34 33.72,24.64 32.77,24.64 32.26,25.15 32.26,26.16 31.15,27.27 RES_WIND1.1
N$30
  Top 0.254: XYGYROYAGC.1 42.11,19.44 U3.15
N$31
  Top 0.254: U3.12 44.45,20.33 43.19,21.59 XYGYROCPOUT.1
N$32
  Top 0.254: XYGYROXAGC.1 47.77,18.91 U3.6
N$33
  Top 0.254: U3.20 41.15,16.28 40.96,16.47 40.96,18.59 39.07,18.59 38.86,18.8 38.86,20.92 RES_WIND2.1
N$34
  Top 0.254: U3.1 47.64,16.27 47.93,16.27 48.26,15.94 48.26,13.97 47.75,13.46 42.33,13.46 RES_WIND3.1
PWMA  (via drill 0.51)
  Top 0.254: ARDUINO.15 12.72,21.1 11.43,19.81 v11.43,17.02 9.4,17.02 A.3
  Bottom 0.254: ICSP.4 22.35,46.48 20.07,46.48 19.56,45.97 19.56,35.05 11.43,26.92 v11.43,17.02
PWMB
  Top 0.254: 7.88,20.07 B.3 9.71,21.9 ARDUINO.14
PWMC
  Top 0.254: ARDUINO.13 14.35,22.71 10.05,22.71 C.3
PWMD
  Top 0.254: ARDUINO.10 13.16,25.1 8.53,29.73 7.89,29.73 D.3
RC-IN1
  Top 0.254: RES_SHT1.1 32.26,36.69 28.26,32.69 28.26,31.24 24.59,27.57 24.59,25.61 24.13,25.15 22.99,25.15 ARDUINO.31
RC-IN2
  Top 0.254: RES_SHT3.1 34.8,38.25 29.15,32.61 29.15,31.24 25.15,27.23 25.15,24.64 24.85,24.34 22.99,24.34 ARDUINO.30
RESET_PIN  (via drill 0.51)
  Top 0.254: 25.83,42.53 C15.1 | 25.83,42.53 RESET.P$2 25.83,30.66 v25.15,29.97 | ICSP.5 25.83,45.21 25.83,42.53 | v24.64,23.62 24.38,23.62 24.13,23.37 23.08,23.37 ARDUINO.29
  Bottom 0.254: v25.15,29.97 25.15,24.13 v24.64,23.62
RX-PPM
  Top 0.254: RES_BATT4.2 RES_BATT5.1 9.67,44.78 21.68,32.77 23.62,32.77 23.92,32.47 23.92,27.98 22.86,26.92 22.86,25.99 ARDUINO.32 22.88,25.98
S
  Top 0.254: A.2 6.47,14.36 L1.1 5.33,11.18 | 5.33,11.18 5.08,11.43 | 5.33,11.18 5.33,11.05 R1.1
SCL  (via drill 0.51)
  Top 0.254: RES_3.3PWR1.2 25.07,13.45 25.9,14.28 25.9,21.07 24.76,22.22 | 24.76,22.22 24.26,22.71 22.96,22.71 ARDUINO.28 | U$2.13 31.43,23.57 30.72,24.28 29.23,24.28 v29.21,24.26 26.8,24.26 24.76,22.22
  Bottom 0.254: I2C.3 43.43,39.37 43.43,32.26 39.88,28.7 39.37,28.7 34.92,24.26 v29.21,24.26
SDA  (via drill 0.51)
  Top 0.254: ARDUINO.27 23.88,21.89 24.66,21.11 v24.66,17.84 RES_3.3PWR2.2 | U$2.14 30.8,20.28 29.6,19.08 v27.96,19.08
  Bottom 0.254: I2C.2 45.72,36.83 44.45,35.56 44.45,31.24 32.26,19.05 27.99,19.05 v27.96,19.08 25.9,19.08 v24.66,17.84

### Text on the board
tPlace: ICSP | FTDI | ULTRASOUND | R/C RECEIVER | Daniel Saul | January 2012 | DGTL | I²C | RESET | ESC4 | y | x | z | Z AXIS | ESC3 | AVR | ADC | X&Y AXIS | ESC2 | ESC1 | Status: | PWR | ADXL335 | PWR | ANALOG | BATT | Low ESR Cap | Order No. 6090 | VREG | VREG | S:/DT/eaglelogo.bmp
bPlace: DTR | RXI | TXO | 3V3 | CTS | GND | 3V3 | MOSI | GND | MISO | SCK | RST | y | z | x | GND | +V | PWM | - | + | "Flying is within our grasp. We have naught to do but take it."